# EAGLE design Vayu_i2c (EAGLE 9.6.2)
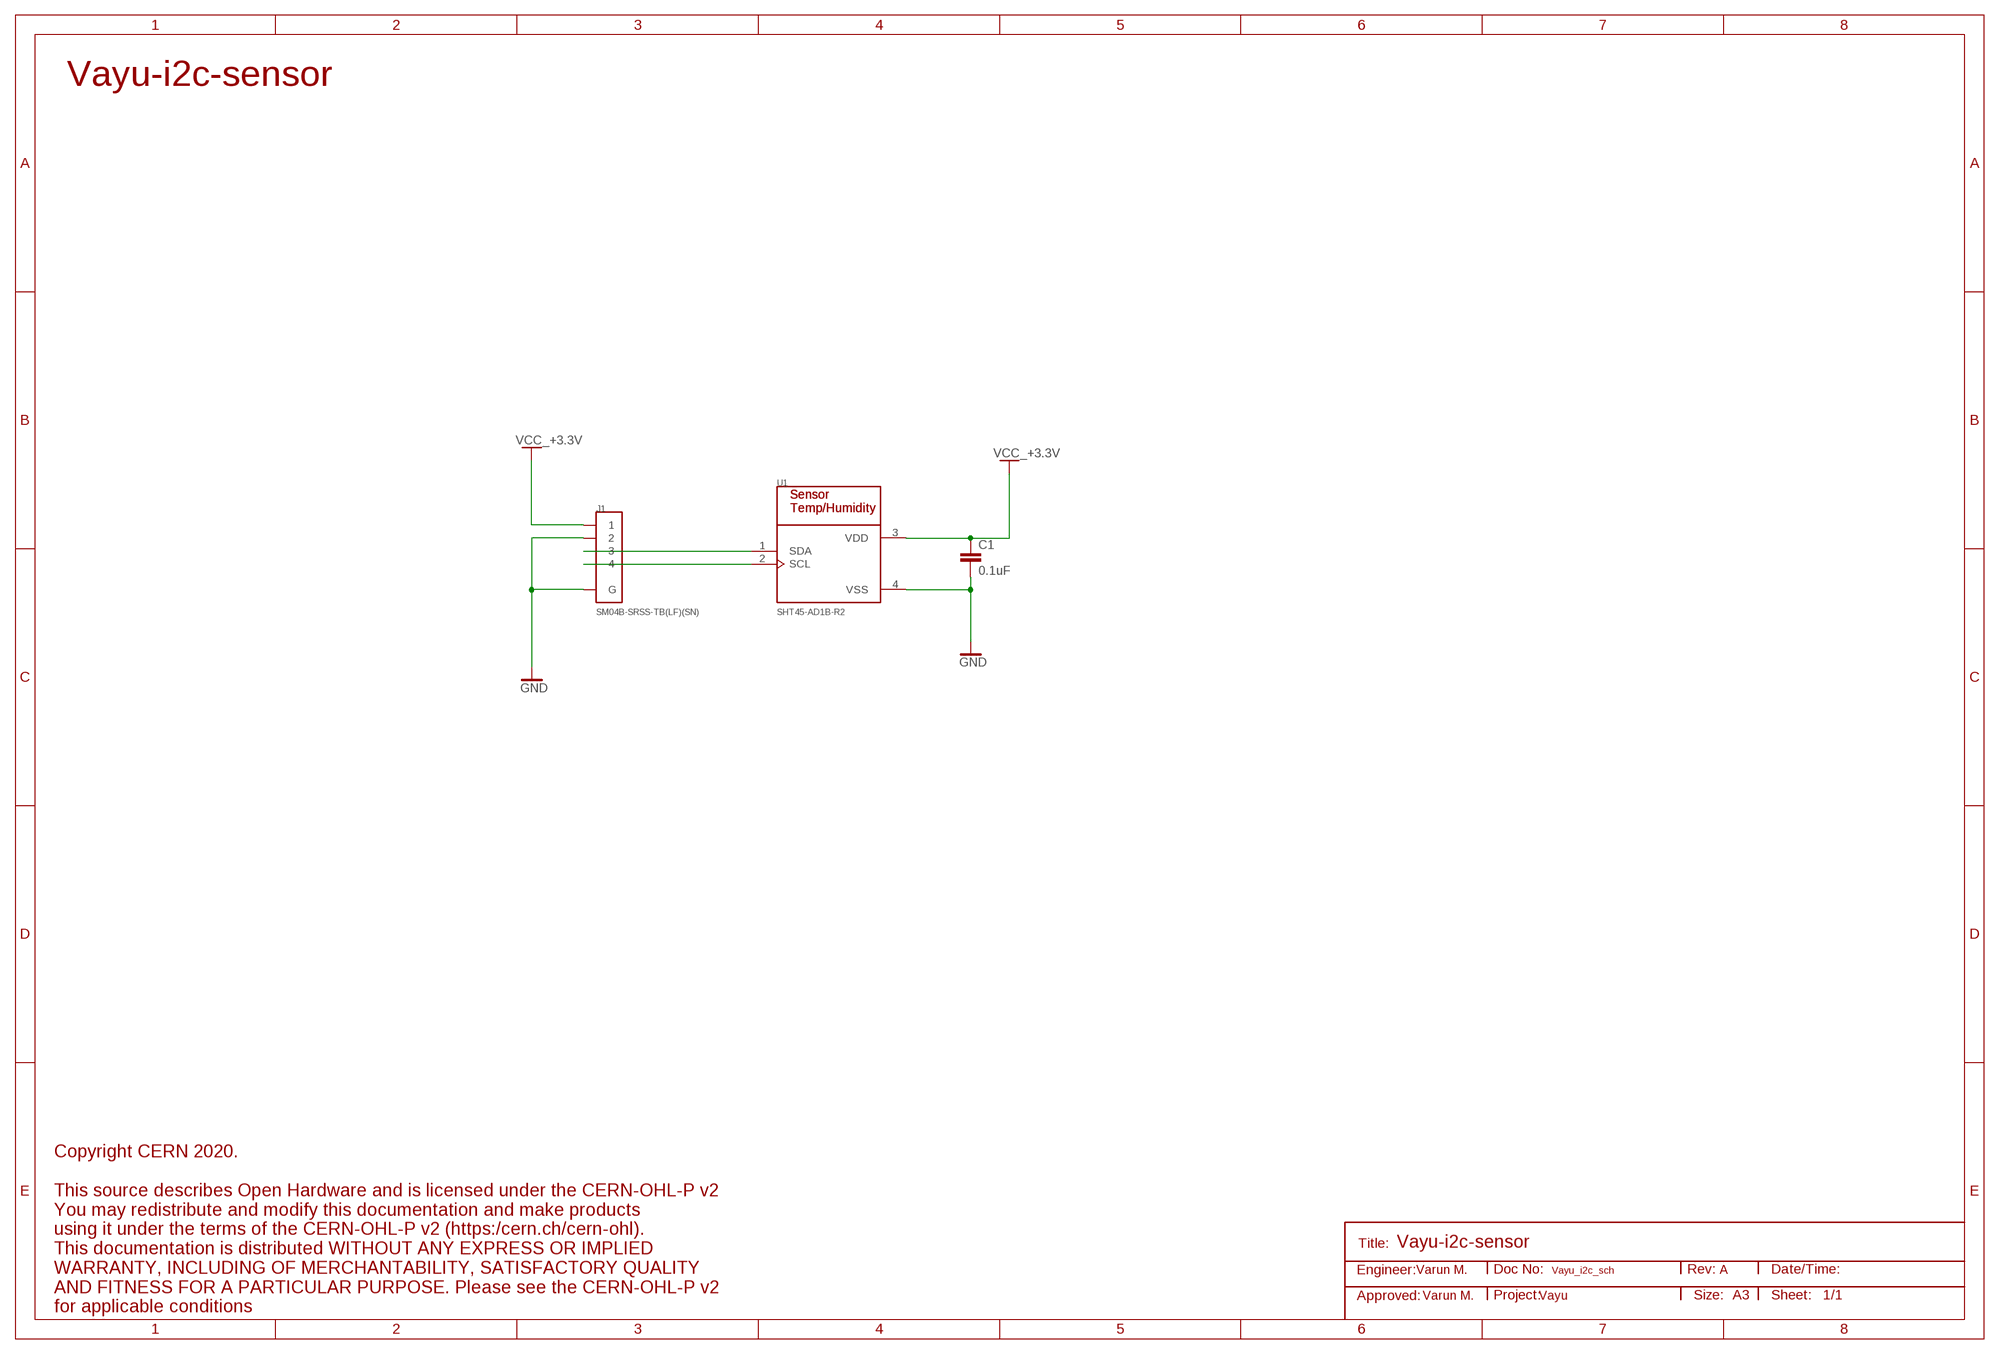
[diagram p0: schematic, sheet 1]
FRAME1 (A3L-LOC-CERN-OHL-P-V2): APPROVER: Varun M.; DESIGNER: Varun M.; DOC_NO: Vayu_i2c_sch; PROJECT_NAME: Vayu; REV: A

## Parts
C1  0.1uF  C-EUC0402  [C0402]
J1  SM04B-SRSS-TB(LF)(SN)  [JST_SM04B-SRSS-TB(LF)(SN)]
U1  SHT45-AD1B-R2  [XDCR_SHT45-AD1B-R2]

## Nets
GND: C1.2 J1.2 J1.S1(G) J1.S2(G) U1.4(VSS)
N$1: J1.3 U1.1(SDA)
N$2: J1.4 U1.2(SCL)
VCC_+3.3V: C1.1 J1.1 U1.3(VDD)

## Notes on the sheet
- Vayu-i2c-sensor
- Vayu-i2c-sensor

## Library data of the parts
C1 = rcl:C-EU: CAPACITOR, European symbol; SPICEPREFIX: C
J1 = connectors:SM04B-SRSS-TB(LF)(SN): SH Series 1.0 mm Pitch 2 Position Single Row Side Entry Shrouded Header; DESCRIPTION: Connector Header Surface Mount, Right Angle 4 position 0.039 (1.00mm); DIGI-KEY_PART_NUMBER: 455-1804-1-ND; MF: JST Sales; MP: SM04B-SRSS-TB(LF)(SN); PACKAGE: None
U1 = sensors_iot:SHT45-AD1B-R2: Sensirion's 4th Generation, High-Accuracy, Ultra-Low-Power, 16-bit Relative Humidity and Temperature Sensor

## Board
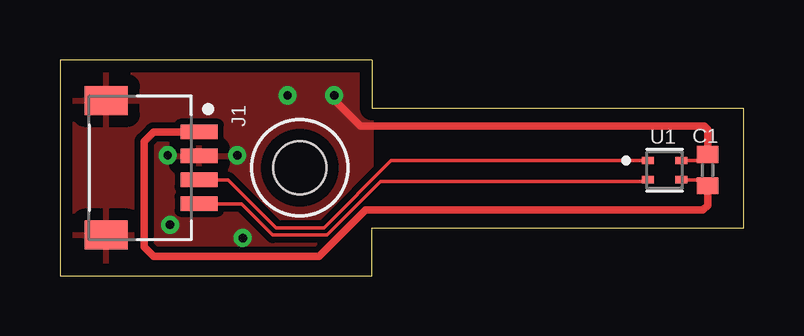
[diagram p1: board, top side]
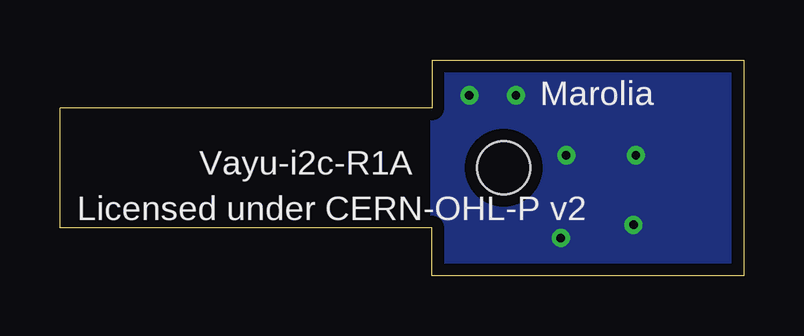
[diagram p2: board, bottom side, seen from below]

Size 28.5 x 9 mm. Coordinates in mm from the lower left corner, seen from the top.
Outline: 0,0 13,0 13,2 28.5,2 28.5,7 13,7 13,9 0,9 0,0
Copper layers (1*16): Top 0.035mm / dielectric 1.5mm / Bottom 0.035mm
Design rules "HRV_i2c": minimum track width 6mil, minimum drill 0.35mm, track to track 6mil, track to pad 6mil, pad to pad 6mil, via to via 6mil, smd to smd 6mil, copper to edge 20mil, drill to drill 6mil, minimum pad ring 7mil, minimum via ring 8mil, stop-mask expansion 4mil, vias tented up to drill 0mil, thermal gap 0.5mm
Holes 2.2 mm at 10,4.5

### Footprints (pad centres in the part's own frame; a part is rotated, then mirrored left to right if it is on the bottom)
C0402 = smd 0.7 x 0.9: 1 -0.65,0; 2 0.65,0
JST_SM04B-SRSS-TB(LF)(SN) = smd 0.6 x 1.55: 1 -1.5,0; 2 -0.5,0; 3 0.5,0; 4 1.5,0 | smd 1.2 x 1.8: S1 -2.8,-3.875; S2 2.8,-3.875
XDCR_SHT45-AD1B-R2 = smd 0.5 x 0.3: 1 -0.7,0.4; 2 -0.7,-0.4; 3 0.7,-0.4; 4 0.7,0.4

### Placement (x,y rotation side)
C1  27,4.4 90 top
J1  5.8,4.5 270 top
U1  25.2,4.4 0 top

### Tracks (layer width: path | path; a pad name or v marks a point on that pad's centre or on a via)
GND  (via drill 0.35)
  Top 0.152: U1.4 26.75,4.8 C1.2
  Top 0.305: C1.2 27,6.1 26.86,6.24 12.53,6.24 11.43,7.34 v11.43,7.52
  other vias: 9.49,7.52 7.62,1.57 4.59,2.12 4.49,5.02 7.39,5.02
  pour Top (isolate 0.254): 0,9 13,9 13,0 0,0
  pour Bottom (isolate 0.254): 0,0 0,9 13,9 13,0.1 13,0
N$1
  Top 0.152: J1.3 7,4 9,2 11,2 13.8,4.8 U1.1
N$2
  Top 0.152: U1.2 24.43,3.93 13.36,3.93 11.13,1.7 8.87,1.7 7.57,3 J1.4
VCC_+3.3V
  Top 0.152: U1.3 26.75,4 C1.1
  Top 0.305: C1.1 27,2.94 26.8,2.73 12.74,2.73 10.8,0.8 3.9,0.8 3.5,1.2 3.5,5.6 3.9,6 J1.1

### Text on the board
bPlace: Marolia | Vayu-i2c-R1A
bNames: Licensed under CERN-OHL-P v2